# Altium schematic sheet p1_control_block.SchDoc
size A2; Organization: Protel International P/L; Address1: L3, 12a Rodborough Rd; Address2: Frenchs Forest; Address3: NSW; Address4: Australia 2086
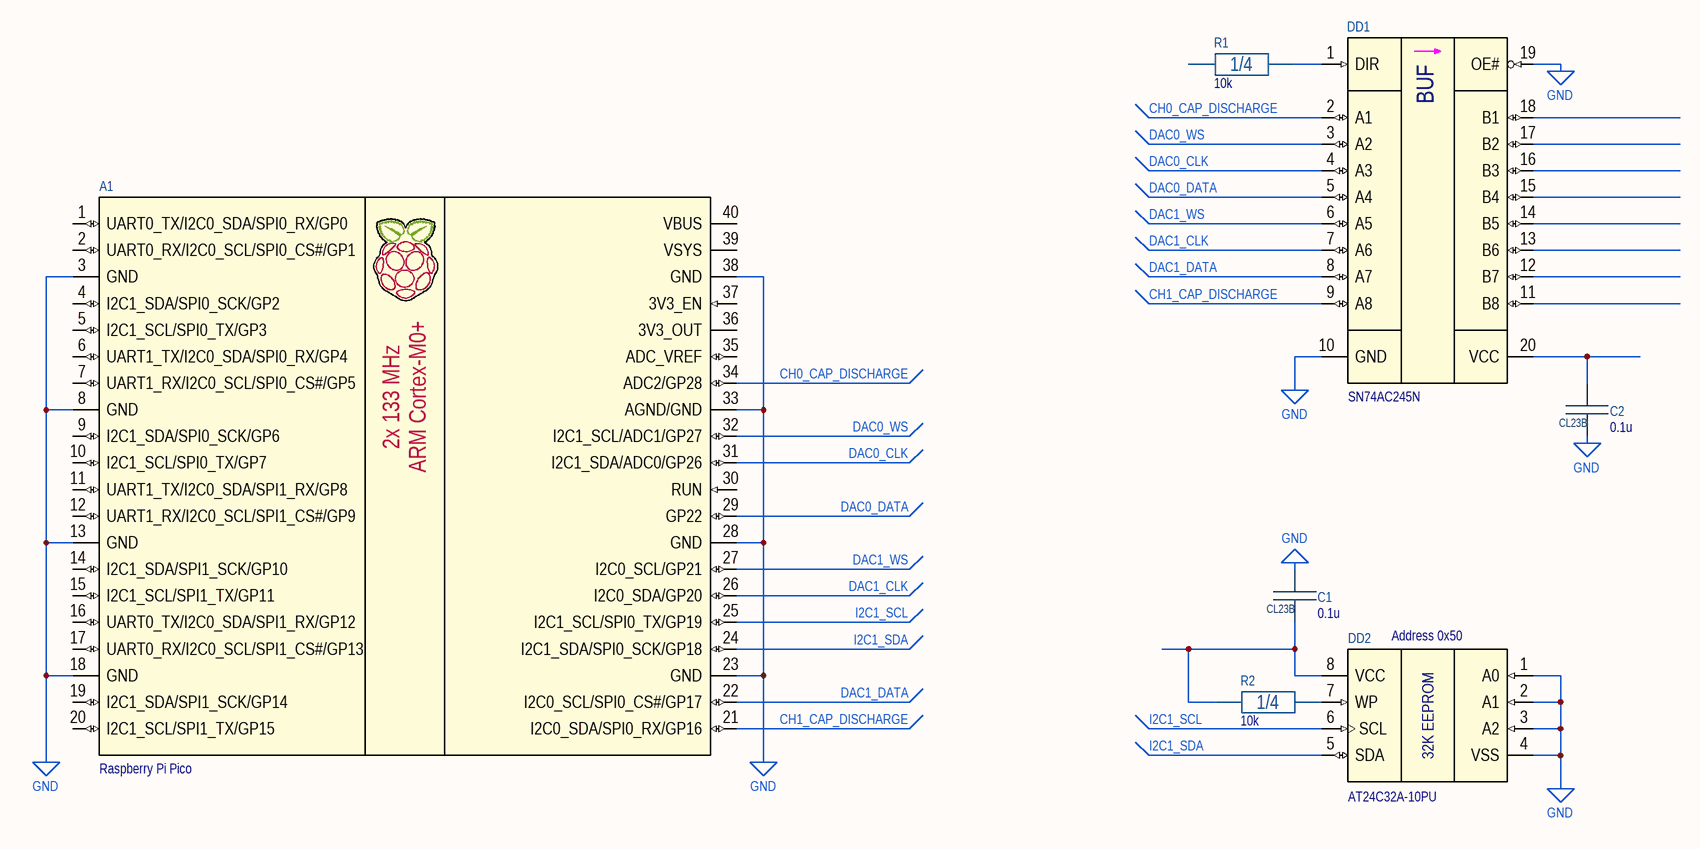
[diagram p0: p1_control_block.SchDoc]

## Parts
A1  Raspberry Pi Pico  [Raspberry_Pi_Pico]
C1  0.1u  [CL23B_7.2x2.5]
C2  0.1u  [CL23B_7.2x2.5]
DD1  SN74AC245N  [DIP-20P-M01]
DD2  AT24C32A-10PU  [DIP-8P-M01_with_SO8]
R1  10k  Package: 1/4  [CFR-25]
R2  10k  Package: 1/4  [CFR-25]

## Nets
GND: A1.3(GND) A1.8(GND) A1.13(GND) A1.18(GND) A1.23(GND) A1.28(GND) A1.33(AGND/GND) A1.38(GND) C1.1 C2.2 DD1.10(GND) DD1.19(OE#) DD2.1(A0) DD2.2(A1) DD2.3(A2) DD2.4(VSS)
CH0_CAP_DISCHARGE: A1.34(ADC2/GP28) DD1.2(A1)
CH1_CAP_DISCHARGE: A1.21(I2C0_SDA/SPI0_RX/GP16) DD1.9(A8)
DAC0_CLK: A1.31(I2C1_SDA/ADC0/GP26) DD1.4(A3)
DAC0_DATA: A1.29(GP22) DD1.5(A4)
DAC0_WS: A1.32(I2C1_SCL/ADC1/GP27) DD1.3(A2)
DAC1_CLK: A1.26(I2C0_SDA/GP20) DD1.7(A6)
DAC1_DATA: A1.22(I2C0_SCL/SPI0_CS#/GP17) DD1.8(A7)
DAC1_WS: A1.27(I2C0_SCL/GP21) DD1.6(A5)
I2C1_SCL: A1.25(I2C1_SCL/SPI0_TX/GP19) DD2.6(SCL)
I2C1_SDA: A1.24(I2C1_SDA/SPI0_SCK/GP18) DD2.5(SDA)
NetC1_2: C1.2 DD2.8(VCC) R2.1
NetC2_1: C2.1 DD1.20(VCC)
NetDD1_1: DD1.1(DIR) R1.2
NetDD2_7: DD2.7(WP) R2.2

Not connected (* = marked no-connect by the designer): A1 1(UART0_TX/I2C0_SDA/SPI0_RX/GP0) 2(UART0_RX/I2C0_SCL/SPI0_CS#/GP1) 4(I2C1_SDA/SPI0_SCK/GP2) 5(I2C1_SCL/SPI0_TX/GP3) 6(UART1_TX/I2C0_SDA/SPI0_RX/GP4) 7(UART1_RX/I2C0_SCL/SPI0_CS#/GP5) 9(I2C1_SDA/SPI0_SCK/GP6) 10(I2C1_SCL/SPI0_TX/GP7) 11(UART1_TX/I2C0_SDA/SPI1_RX/GP8) 12(UART1_RX/I2C0_SCL/SPI1_CS#/GP9) 14(I2C1_SDA/SPI1_SCK/GP10) 15(I2C1_SCL/SPI1_TX/GP11) 16(UART0_TX/I2C0_SDA/SPI1_RX/GP12) 17(UART0_RX/I2C0_SCL/SPI1_CS#/GP13) 19(I2C1_SDA/SPI1_SCK/GP14) 20(I2C1_SCL/SPI1_TX/GP15) 30(RUN) 35(ADC_VREF) 36(3V3_OUT) 37(3V3_EN) 39(VSYS) 40(VBUS); DD1 11(B8) 12(B7) 13(B6) 14(B5) 15(B4) 16(B3) 17(B2) 18(B1); R1 1

## Notes on the sheet
- (near DD2) Address 0x50
- Title
- Size:
- Date:
- File:
- A2
- Number:
- Time:
- Revision:
- Sheet
- of
- (in symbol AT24C32A-10PU) 32K EEPROM
- (in symbol Raspberry Pi Pico) 2x 133 MHz; ARM Cortex-M0+
- (in symbol SN74AC245N) BUF

## Library data of the parts
A1 = Raspberry Pi Pico: Board Raspberry Pi Pico; Part Number: Raspberry Pi Pico; Manufacturer: Raspberry Pi
C1 C2 = CL23B: Box-type metallized polyester film capacitor; Tolerance: ± * %; Voltage: 63V; Value: 0.1u; Dielectric: Polyester; Value on schem: 0.1u; Part Number: *; Manufacturer: *; Package: CL23B
DD1 = SN74AC245N: 8-bit Bus Transceiver with 3-state outputs; Manufacturer: Texas Instruments; Part Number: SN74AC245N; Package: DIP-20
DD2 = AT24C32A-10PU: 32K I2C Serial EEPROM; Manufacturer: Microchip Technology; Package: DIP-8; Part Number: AT24C32A-10PU
R1 R2 = CF25: Resistor 1/4W; Part Number: MFR-25FTF52-10K; Manufacturer: Yageo; Tolerance: ± 1 %; Voltage: 250V; Temperature Coefficient: ±100 ppm/°C; Value: 10k; Value on schem: 10k